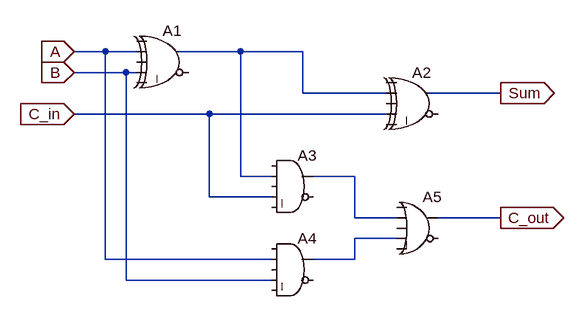
[diagram p0: schematic Full_Adder.asc]
Full_Adder.asc, the LTspice schematic file:
Version 4
SHEET 1 880 708
WIRE -96 64 -144 64
WIRE -48 64 -96 64
WIRE 112 64 16 64
WIRE 208 64 112 64
WIRE -64 96 -144 96
WIRE -48 96 -64 96
WIRE 208 128 208 64
WIRE 336 128 208 128
WIRE 512 128 400 128
WIRE 64 160 -144 160
WIRE 336 160 64 160
WIRE 112 256 112 64
WIRE 160 256 112 256
WIRE 288 256 224 256
WIRE 64 288 64 160
WIRE 160 288 64 288
WIRE 288 320 288 256
WIRE 352 320 288 320
WIRE 512 320 416 320
WIRE 352 352 288 352
WIRE -96 384 -96 64
WIRE 160 384 -96 384
WIRE 288 384 288 352
WIRE 288 384 224 384
WIRE -64 416 -64 96
WIRE 160 416 -64 416
FLAG -144 64 A
IOPIN -144 64 In
FLAG -144 96 B
IOPIN -144 96 In
FLAG -144 160 C_in
IOPIN -144 160 In
FLAG 512 128 Sum
IOPIN 512 128 Out
FLAG 512 320 C_out
IOPIN 512 320 Out
SYMBOL Digital\\xor 0 16 R0
SYMATTR InstName A1
SYMBOL Digital\\xor 384 80 R0
SYMATTR InstName A2
SYMBOL Digital\\and 192 208 R0
SYMATTR InstName A3
SYMBOL Digital\\and 192 336 R0
SYMATTR InstName A4
SYMBOL Digital\\or 384 272 R0
SYMATTR InstName A5

The netlist it stands for:
* Full_Adder.asc
A1 0 A 0 B 0 0 N001 0 XOR
A2 0 N001 0 C_in 0 0 Sum 0 XOR
A3 0 N001 0 C_in 0 0 N002 0 AND
A4 0 A 0 B 0 0 N003 0 AND
A5 0 N002 0 N003 0 0 C_out 0 OR
.backanno
.end